# EAGLE design F4_mini2 (EAGLE 7.2.0)
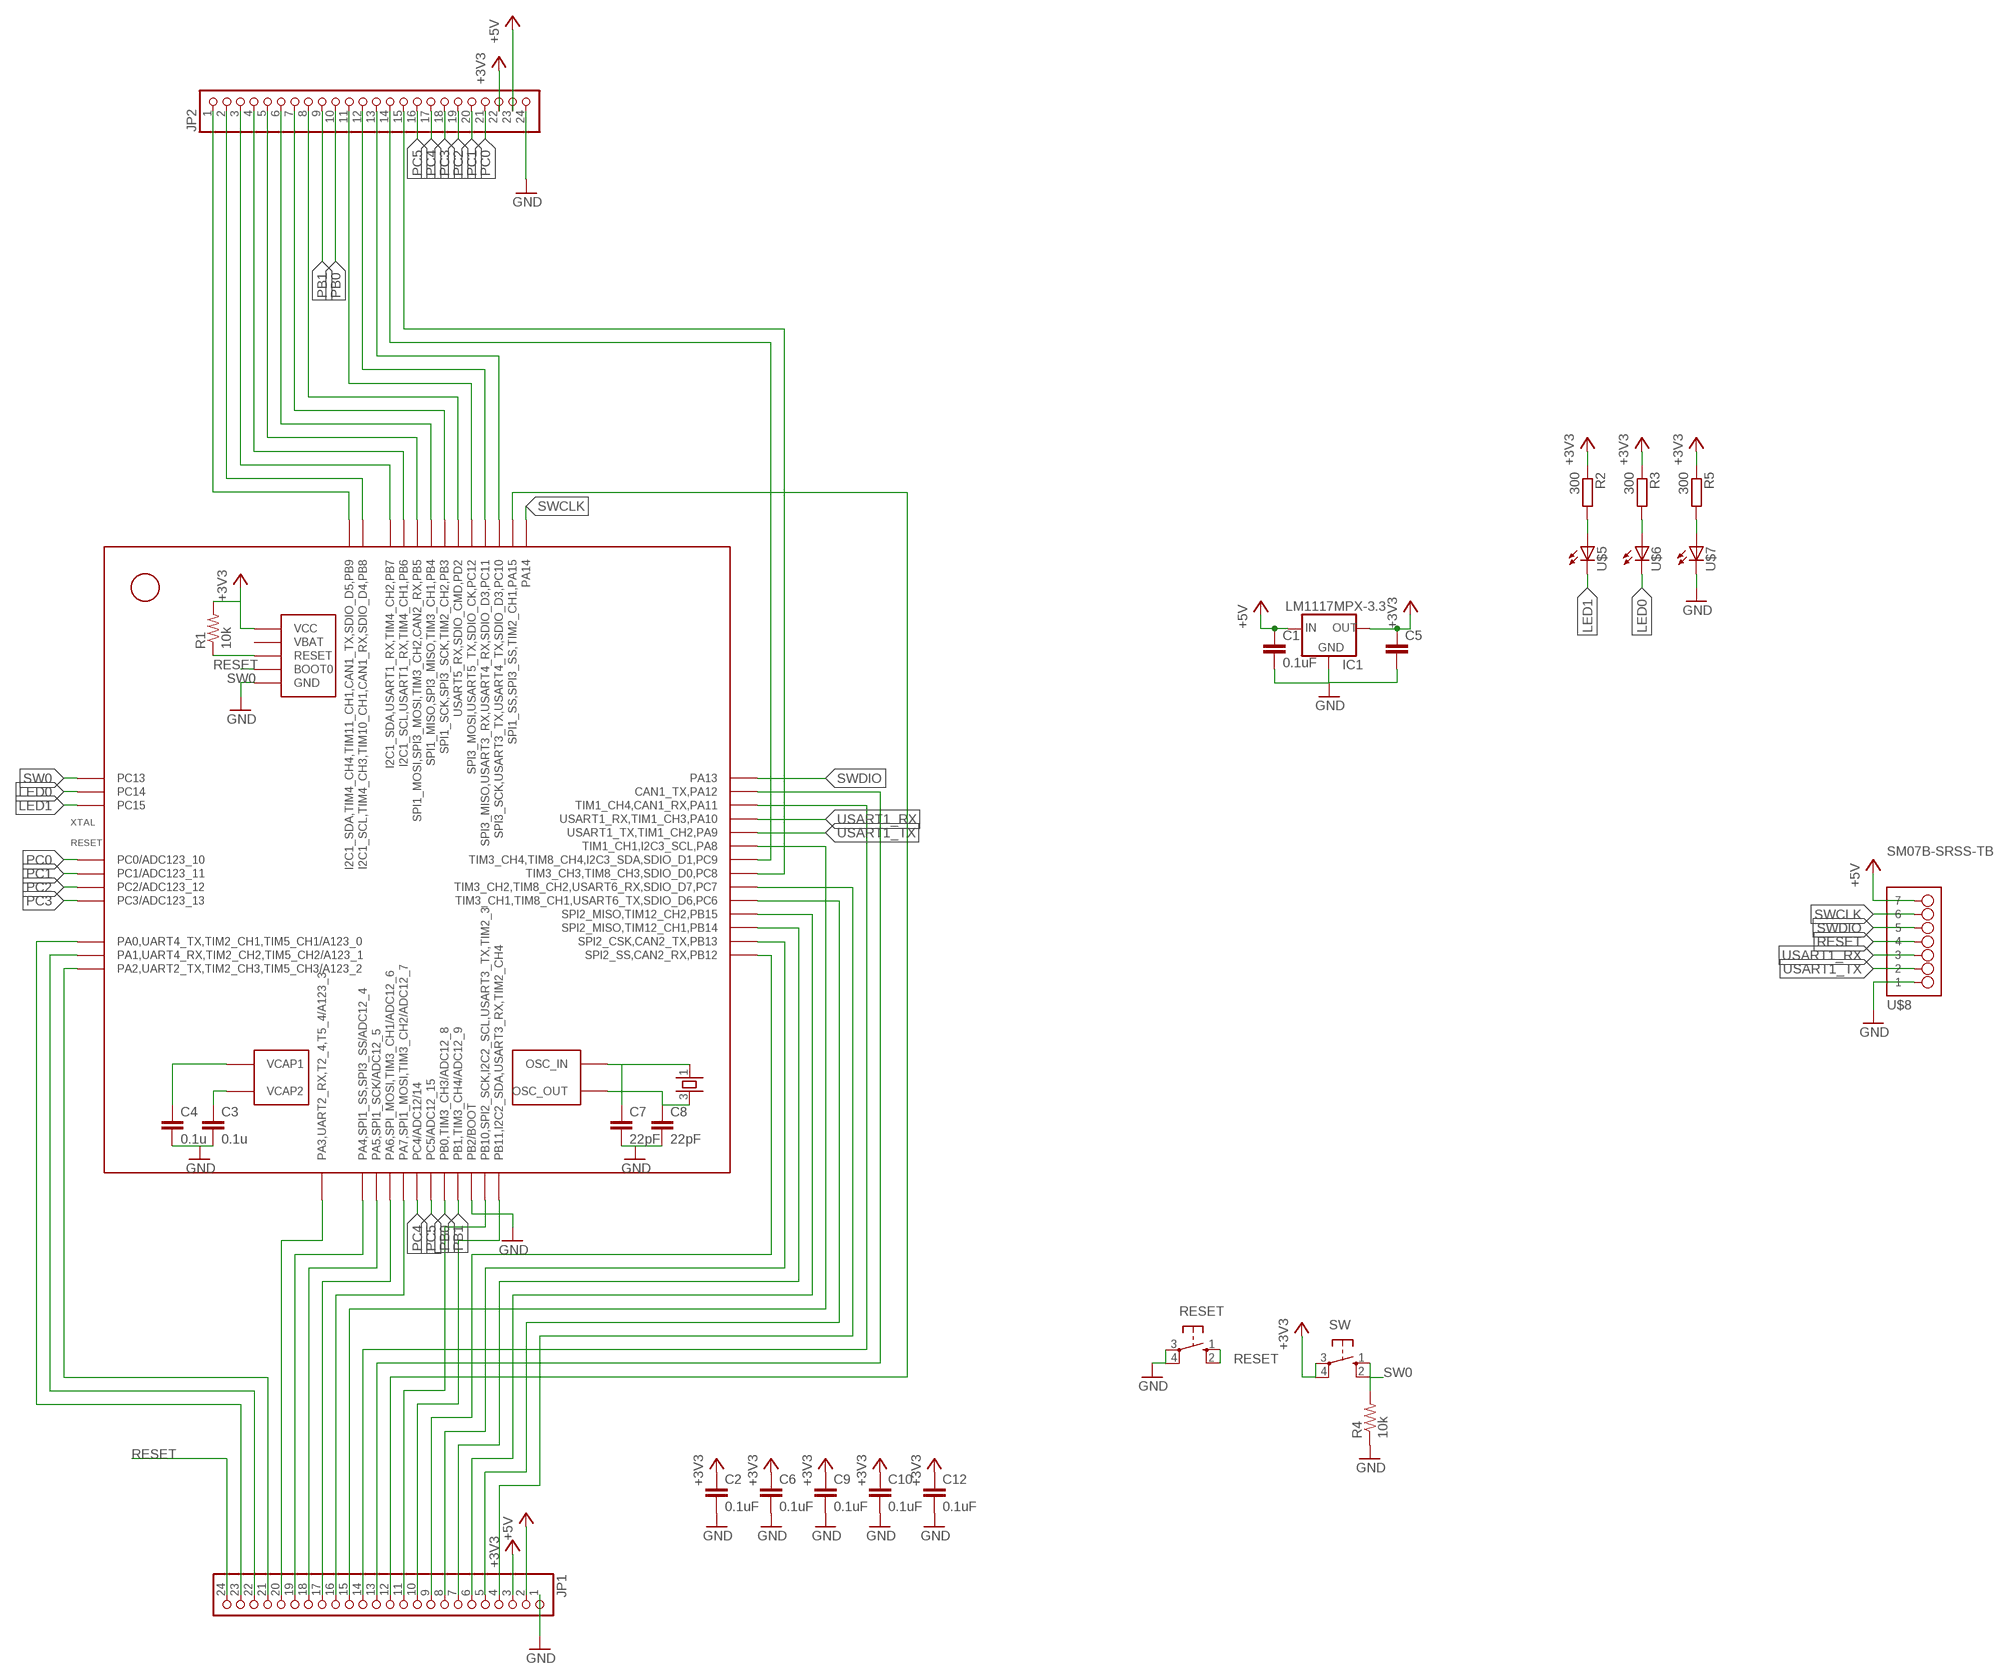
[diagram p0: schematic, sheet 1]

## Parts
C1  0.1uF  C-EUC0603K  [C0603K]
C2  0.1uF  C-EUC0603  [C0603]
C3  0.1u  C-EUC0603K  [C0603K]
C4  0.1u  C-EUC0603K  [C0603K]
C5  C-EUC0603K  [C0603K]
C6  0.1uF  C-EUC0603  [C0603]
C7  22pF  C-EUC0603K  [C0603K]
C8  22pF  C-EUC0603K  [C0603K]
C9  0.1uF  C-EUC0603  [C0603]
C10  0.1uF  C-EUC0603  [C0603]
C12  0.1uF  C-EUC0603  [C0603]
IC1  LM1117MPX-3.3  LM1117  [SOT223]
JP1  PINHD-1X24  [1X24]
JP2  PINHD-1X24  [1X24]
R1  10k  R-US_R0603  [R0603]
R2  300  R-EU_R0603  [R0603]
R3  300  R-EU_R0603  [R0603]
R4  10k  R-US_R0603  [R0603]
R5  300  R-EU_R0603  [R0603]
RESET  10-XX  [B3F-10XX]
SW  10-XX  [B3F-10XX]
U$1  STM32F405_T  [LQFP64]
U$4  25MHz  ASF_T  [ASF]
U$5  0603  [0603]
U$6  0603  [0603]
U$7  0603  [0603]
U$8  SM07B-SRSS-TB  [SM07B-SRSS-TB]

## Nets
+3V3: C2.1 C5.1 C6.1 C9.1 C10.1 C12.1 IC1.2(OUT1) IC1.4(OUT) JP1.3 JP2.22 R1.2 R2.1 R3.1 R5.1 SW.3(P) SW.4(P1) U$1.13(VCC) U$1.19(VCC) U$1.32(VCC) U$1.48(VCC) U$1.64(VCC)
+5V: C1.1 IC1.3(IN) JP1.2 JP2.23 U$8.P$7
A: JP2.3 U$1.59(I2C1_SDA,USART1_RX,TIM4_CH2,PB7)
GND: C1.2 C2.2 C3.2 C4.2 C5.2 C6.2 C7.2 C8.2 C9.2 C10.2 C12.2 IC1.1(GND) JP1.1 JP2.24 R4.1 RESET.3(P) RESET.4(P1) U$1.12(GND) U$1.18(GND) U$1.28(PB2/BOOT) U$1.63(GND) U$7.C U$8.P$1
LED0: U$1.3(PC14) U$6.C
LED1: U$1.4(PC15) U$5.C
N$1: R2.2 U$5.A
N$2: JP1.21 U$1.16(PA2,UART2_TX,TIM2_CH3,TIM5_CH3/A123_2)
N$3: JP1.23 U$1.14(PA0,UART4_TX,TIM2_CH1,TIM5_CH1/A123_0)
N$4: JP1.22 U$1.15(PA1,UART4_RX,TIM2_CH2,TIM5_CH2/A123_1)
N$5: JP1.15 U$1.41(TIM1_CH1,I2C3_SCL,PA8)
N$6: JP1.17 U$1.22(PA6,SPI_MOSI,TIM3_CH1/ADC12_6)
N$7: JP1.18 U$1.21(PA5,SPI1_SCK/ADC12_5)
N$8: JP1.19 U$1.20(PA4,SPI1_SS,SPI3_SS/ADC12_4)
N$9: JP1.20 U$1.17(PA3,UART2_RX,T2_4,T5_4/A123_3)
N$10: JP1.5 U$1.37(TIM3_CH1,TIM8_CH1,USART6_TX,SDIO_D6,PC6)
N$11: R3.2 U$6.A
N$12: R5.2 U$7.A
N$13: JP1.14 U$1.44(TIM1_CH4,CAN1_RX,PA11)
N$14: JP1.13 U$1.45(CAN1_TX,PA12)
N$15: JP1.4 U$1.38(TIM3_CH2,TIM8_CH2,USART6_RX,SDIO_D7,PC7)
N$17: JP1.16 U$1.23(PA7,SPI1_MOSI,TIM3_CH2/ADC12_7)
N$18: JP2.2 U$1.61(I2C1_SCL,TIM4_CH3,TIM10_CH1,CAN1_RX,SDIO_D4,PB8)
N$19: JP2.1 U$1.62(I2C1_SDA,TIM4_CH4,TIM11_CH1,CAN1_TX,SDIO_D5,PB9)
N$20: JP1.8 U$1.34(SPI2_CSK,CAN2_TX,PB13)
N$21: JP1.9 U$1.33(SPI2_SS,CAN2_RX,PB12)
N$22: JP1.10 U$1.30(PB11,I2C2_SDA,USART3_RX,TIM2_CH4)
N$23: JP1.11 U$1.29(PB10,SPI2_SCK,I2C2_SCL,USART3_TX,TIM2_3)
N$24: JP1.12 U$1.50(SPI1_SS,SPI3_SS,TIM2_CH1,PA15)
N$27: JP2.4 U$1.58(I2C1_SCL,USART1_RX,TIM4_CH1,PB6)
N$28: JP2.5 U$1.57(SPI1_MOSI,SPI3_MOSI,TIM3_CH2,CAN2_RX,PB5)
N$30: JP2.6 U$1.56(SPI1_MISO,SPI3_MISO,TIM3_CH1,PB4)
N$31: JP2.7 U$1.55(SPI1_SCK,SPI3_SCK,TIM2_CH2,PB3)
N$32: JP2.8 U$1.54(USART5_RX,SDIO_CMD,PD2)
N$38: JP2.11 U$1.53(SPI3_MOSI,USART5_TX,SDIO_CK,PC12)
N$39: JP2.12 U$1.52(SPI3_MISO,USART3_RX,USART4_RX,SDIO_D3,PC11)
N$40: JP2.13 U$1.51(SPI3_SCK,USART3_TX,USART4_TX,SDIO_D3,PC10)
N$41: C3.1 U$1.47(VCAP2)
N$42: C4.1 U$1.31(VCAP1)
N$43: JP2.14 U$1.40(TIM3_CH4,TIM8_CH4,I2C3_SDA,SDIO_D1,PC9)
N$44: C7.1 U$1.5(OSC_IN) U$4.1
N$45: C8.1 U$1.6(OSC_OUT) U$4.3
N$46: JP2.15 U$1.39(TIM3_CH3,TIM8_CH3,SDIO_D0,PC8)
PB0: JP2.10 U$1.26(PB0,TIM3_CH3/ADC12_8)
PB1: JP2.9 U$1.27(PB1,TIM3_CH4/ADC12_9)
PB14: JP1.7 U$1.35(SPI2_MISO,TIM12_CH1,PB14)
PB15: JP1.6 U$1.36(SPI2_MISO,TIM12_CH2,PB15)
PC0: JP2.21 U$1.8(PC0/ADC123_10)
PC1: JP2.20 U$1.9(PC1/ADC123_11)
PC2: JP2.19 U$1.10(PC2/ADC123_12)
PC3: JP2.18 U$1.11(PC3/ADC123_13)
PC4: JP2.17 U$1.24(PC4/ADC12/14)
PC5: JP2.16 U$1.25(PC5/ADC12_15)
RESET: JP1.24 R1.1 RESET.1(S) RESET.2(S1) U$1.7(RESET) U$8.P$4
SW0: R4.2 SW.1(S) SW.2(S1) U$1.2(PC13) U$1.60(BOOT0)
SWCLK: U$1.49(PA14) U$8.P$6
SWDIO: U$1.46(PA13) U$8.P$5
USART1_RX: U$1.43(USART1_RX,TIM1_CH3,PA10) U$8.P$3
USART1_TX: U$1.42(USART1_TX,TIM1_CH2,PA9) U$8.P$2
Unconnected: U$1.1(VBAT)

## Library data of the parts
C1-C10 C12 = resistor:C-EU: CAPACITOR, European symbol
IC1 = VoltageRegulator:LM1117
JP1 JP2 = pinhead:PINHD-1X24: PIN HEADER
R1 R4 = resistor:R-US_: RESISTOR, American symbol
R2 R3 R5 = resistor:R-EU_: RESISTOR, European symbol
RESET SW = switch-omron:10-XX: OMRON SWITCH; MPN: B3F-1000; OC_FARNELL: 176432; OC_NEWARK: 36M3542
U$1 = stm32f:STM32F405_T
U$4 = crystal:ASF_T
U$5-U$7 = led_0603:0603
U$8 = con-jst-sh:SM07B-SRSS-TB

## Board
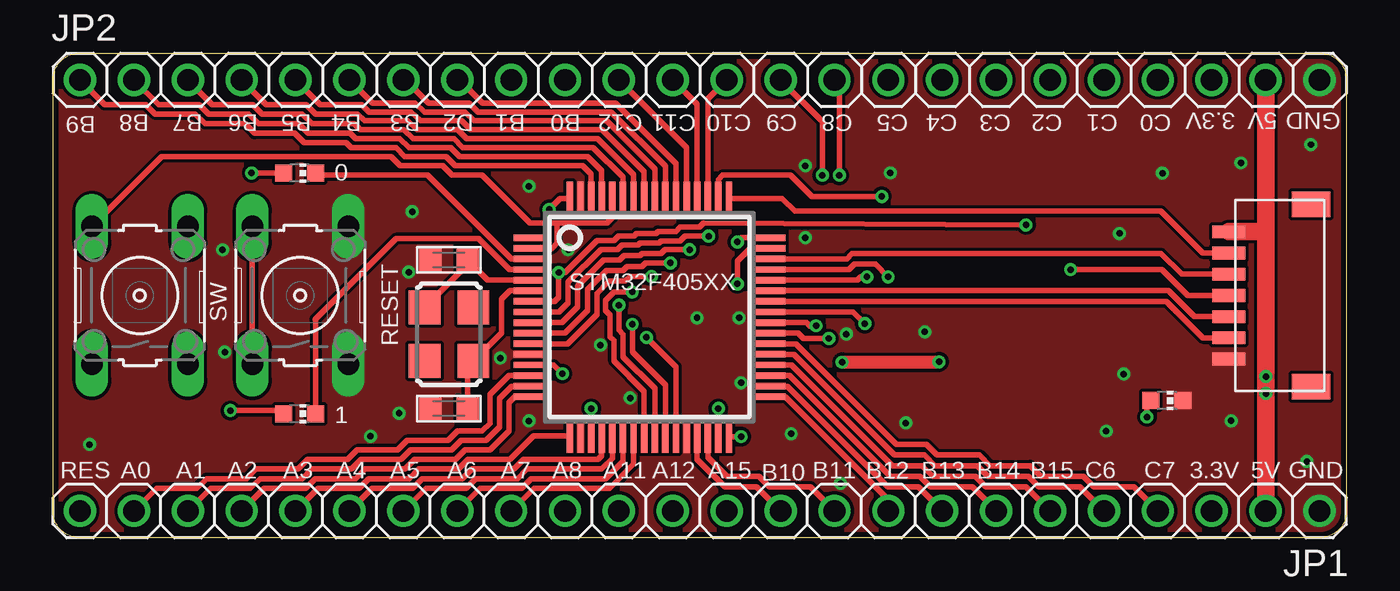
[diagram p1: board, top side]
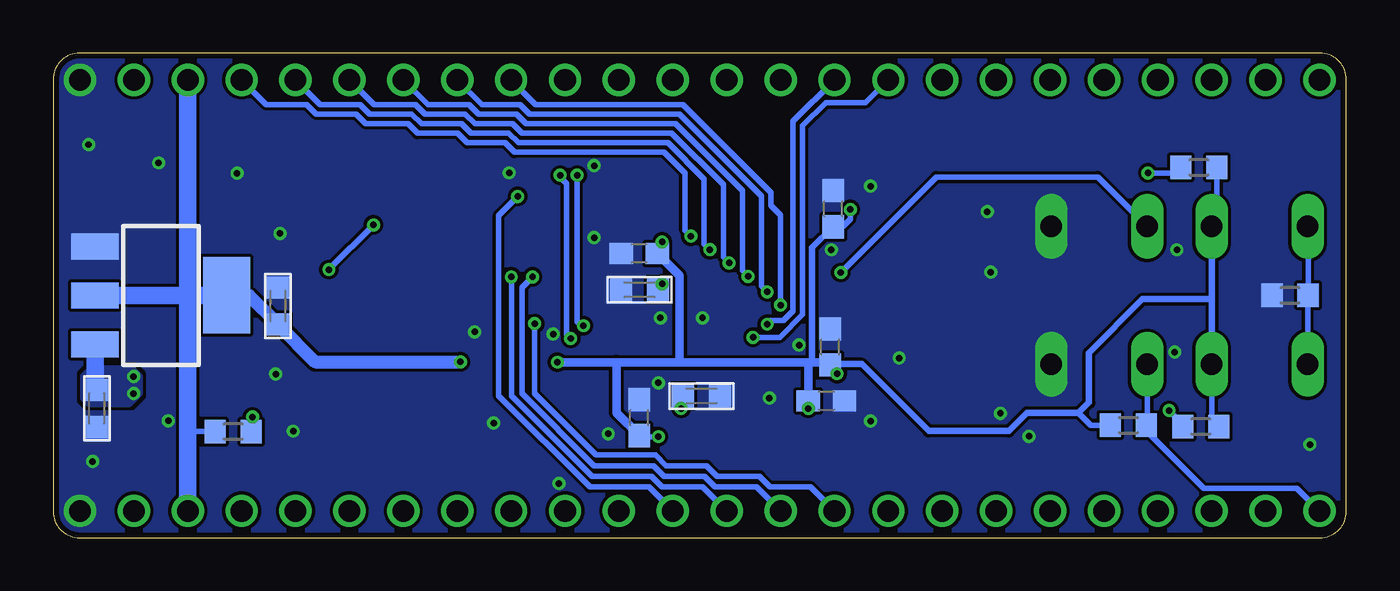
[diagram p2: board, bottom side, seen from below]

Size 60.96 x 22.86 mm. Coordinates in mm from the lower left corner, seen from the top.
Outline: 0,21.61 arc-90 1.25,22.86 59.71,22.86 arc-90 60.96,21.61 60.96,1.25 arc-90 59.71,0 1.25,0 arc-90 0,1.25 0,21.61
Copper layers (1*16): Top 0.035mm / dielectric 1.5mm / Bottom 0.035mm
Design rules "hoge": minimum track width 6mil, minimum drill 12mil, track to track 6mil, track to pad 6mil, pad to pad 6mil, via to via 6mil, smd to smd 0mil, copper to edge 10mil, drill to drill 10mil, minimum pad ring 10mil, minimum via ring 6mil, stop-mask expansion 2mil, vias tented up to drill 100mil, thermal gap 10mil

### Footprints (pad centres in the part's own frame; a part is rotated, then mirrored left to right if it is on the bottom)
C0603K = smd 1.05 x 1.08: 1 -0.875,0; 2 0.875,0
C0603 = smd 1.1 x 1: 1 -0.85,0; 2 0.85,0
SOT223 = smd 1.219 x 2.235: 1 -2.311,-3.099; 2 0,-3.099; 3 2.311,-3.099 | smd 3.6 x 2.2: 4 0,3.099
1X24 = drill 1.016: 1 -29.21,0; 2 -26.67,0; 3 -24.13,0; 4 -21.59,0; 5 -19.05,0; 6 -16.51,0; 7 -13.97,0; 8 -11.43,0; 9 -8.89,0; 10 -6.35,0; 11 -3.81,0; 12 -1.27,0; 13 1.27,0; 14 3.81,0; 15 6.35,0; 16 8.89,0; 17 11.43,0; 18 13.97,0; 19 16.51,0; 20 19.05,0; 21 21.59,0; 22 24.13,0; 23 26.67,0; 24 29.21,0
R0603 = smd 1 x 1.1: 1 -0.85,0; 2 0.85,0
B3F-10XX = drill 1.016 long: 1 -3.251,2.261; 2 3.251,2.261; 3 -3.251,-2.261; 4 3.251,-2.261
LQFP64 = smd 1.6 x 0.3: 1 -5.6,3.75; 2 -5.6,3.25; 3 -5.6,2.75; 4 -5.6,2.25; 5 -5.6,1.75; 6 -5.6,1.25; 7 -5.6,0.75; 8 -5.6,0.25; 9 -5.6,-0.25; 10 -5.6,-0.75; 11 -5.6,-1.25; 12 -5.6,-1.75; 13 -5.6,-2.25; 14 -5.6,-2.75; 15 -5.6,-3.25; 16 -5.6,-3.75; 33 5.6,-3.75; 34 5.6,-3.25; 35 5.6,-2.75; 36 5.6,-2.25; 37 5.6,-1.75; 38 5.6,-1.25; 39 5.6,-0.75; 40 5.6,-0.25; 41 5.6,0.25; 42 5.6,0.75; 43 5.6,1.25; 44 5.6,1.75; 45 5.6,2.25; 46 5.6,2.75; 47 5.6,3.25; 48 5.6,3.75 | smd 0.3 x 1.6: 17 -3.75,-5.6; 18 -3.25,-5.6; 19 -2.75,-5.6; 20 -2.25,-5.6; 21 -1.75,-5.6; 22 -1.25,-5.6; 23 -0.75,-5.6; 24 -0.25,-5.6; 25 0.25,-5.6; 26 0.75,-5.6; 27 1.25,-5.6; 28 1.75,-5.6; 29 2.25,-5.6; 30 2.75,-5.6; 31 3.25,-5.6; 32 3.75,-5.6; 49 3.75,5.6; 50 3.25,5.6; 51 2.75,5.6; 52 2.25,5.6; 53 1.75,5.6; 54 1.25,5.6; 55 0.75,5.6; 56 0.25,5.6; 57 -0.25,5.6; 58 -0.75,5.6; 59 -1.25,5.6; 60 -1.75,5.6; 61 -2.25,5.6; 62 -2.75,5.6; 63 -3.25,5.6; 64 -3.75,5.6
ASF = smd 1.6 x 1.5: 1 -1.25,-1.15; 2 1.25,-1.15; 3 1.25,1.15; 4 -1.25,1.15
0603 = smd 0.8 x 0.8: A 0,-0.75; C 0,0.75
SM07B-SRSS-TB = smd 0.6 x 1.55: P$1 -3,0; P$2 -2,0; P$3 -1,0; P$4 0,0; P$5 1,0; P$6 2,0; P$7 3,0 | smd 1.2 x 1.8: P$8 -4.3,-3.875; P$9 4.3,-3.875

### Placement (x,y rotation side)
C1  58.9,6.1 270 bottom
C2  24.33,9 90 bottom
C3  33.32,11.7 180 bottom
C4  30.4,6.69 0 bottom
C5  50.36,10.93 90 bottom
C6  24.19,15.52 90 bottom
C7  18.66,13.1 180 top
C8  18.66,6.1 180 top
C9  24.51,6.46 0 bottom
C10  33.33,5.67 90 bottom
C12  33.33,13.41 180 bottom
IC1  55.88,11.43 270 bottom
JP1  30.48,1.27 180 top
JP2  30.48,21.59 0 top
R1  10.28,5.31 180 bottom
R2  6.86,5.25 180 bottom
R3  6.96,17.47 180 bottom
R4  2.66,11.44 0 bottom
R5  52.47,5.01 0 bottom
RESET  11.65,11.43 90 top
SW  4.09,11.43 90 top
U$1  28.11,10.4 0 top
U$4  18.66,9.6 270 top
U$5  11.62,5.85 270 top
U$6  11.62,17.2 270 top
U$7  52.5,6.47 270 top
U$8  55.42,11.43 90 top

### Tracks (layer width: path | path; a pad name or v marks a point on that pad's centre or on a via)
+3V3  (via drill 0.3)
  Top 0.254: v32.25,13.95 32.45,14.15 U$1.48 | U$1.32 31.89,4.77 v32.43,4.77 | U$1.64 23.9,16 v23.38,15.48 | U$1.13 23.6,8.15 v24.01,7.74 | U$1.19 v25.36,6.1
  Top 0.61: v41.76,8.3 41.74,8.28 v37.19,8.28
  Bottom 0.254: v32.25,13.95 32.25,13.64 C12.1 | v32.43,4.77 33.28,4.77 C10.1 | R1.2 12.04,5.31 12.62,5.89 | v23.38,15.48 23.38,15.03 23.74,14.67 C6.1 | 24.46,8.28 C2.1 24.01,7.83 v24.01,7.74 | v25.36,6.1 C9.1 | R3.1 6.11,14.92 SW.4 | SW.3 6.35,5.59 R2.1 | R5.1 54.6,5.01 54.61,5
  Bottom 0.305: C6.1 25.18,13.68 25.18,8.28 | C2.1 24.29,8.19 22.84,8.19 19.69,5.04 15.91,5.04 15.05,5.89 12.62,5.89 12.14,6.38 12.14,8.72 9.61,11.25 6.4,11.25 6.35,11.2 | SW.4 6.35,11.2 | 6.35,11.2 SW.3
  Bottom 0.406: v37.19,8.28 34.41,8.28 | 34.41,8.28 31.44,8.28 | 31.44,8.28 25.41,8.28 | 25.41,8.28 25.18,8.28 24.46,8.28 | C12.1 31.44,12.37 31.44,8.28 | C9.1 25.36,8.23 25.41,8.28 | C10.1 34.41,5.9 34.41,8.28
  Bottom 0.61: IC1.4 51.73,11.43 C5.1 48.61,8.3 v41.76,8.3
  Bottom 0.813: JP2.22 54.61,11.3 | 54.61,11.3 54.61,5 JP1.3 | IC1.2 54.74,11.43 54.61,11.3 | IC1.4 54.48,11.43 54.61,11.3
+5V  (via drill 0.3)
  Top 0.254: v57.16,6.8 57.16,5.51 57.15,5.5
  Top 0.813: JP2.23 57.15,14.5 | 57.15,14.5 57.15,5.5 JP1.2 | U$8.P$7 57.08,14.43 57.15,14.5
  Bottom 0.813: IC1.3 58.98,7.05 C1.1
  other vias: 57.16,7.6
  pour Bottom (no thermals): 57.26,8 59.16,8 59.56,7.6 59.56,6.6 59.26,6.3 57.36,6.3 56.86,6.8 56.86,7.6
A
  Top 0.254: U$1.59 26.86,17 25.46,18.4 19.31,18.4 18.89,18.82 16.97,18.82 16.52,19.24 14.47,19.24 14.18,19.53 12.2,19.53 11.75,19.98 9.86,19.98 9.41,20.43 7.51,20.43 JP2.3
GND  (via drill 0.3)
  other vias: 55.99,17.68 52.29,17.19 37.12,2.56 34.79,4.91 55.53,5.52 59.28,18.54 59.1,3.6 50.26,14.35 50.46,7.72 39.46,17.21 49.64,5.03 32.33,10.37 30.35,10.37 32.43,7.31 27.2,6.59 22.43,5.51 14.96,4.79 16.31,5.87 16.76,12.53 7.99,13.58 8.09,8.76 1.72,4.4 22.43,16.58 21.08,8.48 35.46,17.55 35.46,14.15 24.28,13.58 40.19,5.41 41.09,9.71 37.39,9.61 25.8,9.09 16.93,15.38
  pour Top (rank 6, no thermals): -4,26.86 67.5,26.86 67.5,-4 -4,-4
  pour Bottom (rank 6, no thermals): -2,24.86 62.96,24.86 62.96,-2 -2,-2
LED0
  Top 0.254: U$6.C 12.47,17.1 17.66,17.1 21.61,13.15 U$1.3
LED1
  Top 0.254: U$1.4 21.51,12.65 20.06,14.1 16.16,14.1 12.36,10.3 12.37,10.29 U$5.C
N$1  (via drill 0.3)
  Top 0.254: v8.36,6 10.72,6 U$5.A
  Bottom 0.254: R2.2 7.71,5.35 v8.36,6
N$2
  Top 0.254: U$1.16 21.75,6.65 21.49,6.39 21.49,5.04 20.59,4.14 19.42,4.14 18.97,3.69 17.04,3.69 16.59,3.24 14.7,3.24 14.25,2.79 12.36,2.79 11.91,2.34 9.96,2.34 JP1.21
N$3
  Top 0.254: U$1.14 21.49,7.65 20.59,6.75 20.59,5.4 20.23,5.04 19.06,5.04 18.61,4.59 16.68,4.59 16.23,4.14 14.34,4.14 13.89,3.69 12,3.69 11.55,3.24 9.57,3.24 9.12,2.79 7.23,2.79 6.78,2.34 4.88,2.34 JP1.23
N$4
  Top 0.254: U$1.15 21.62,7.15 21.04,6.57 21.04,5.22 20.41,4.59 19.24,4.59 18.79,4.14 16.86,4.14 16.41,3.69 14.52,3.69 14.07,3.24 12.18,3.24 11.73,2.79 9.75,2.79 9.3,2.34 7.42,2.34 JP1.22
N$5  (via drill 0.3)
  Top 0.254: U$1.41 37.71,10.65 v38.26,10.1
  Bottom 0.254: JP1.15 25.26,2.4 27.16,2.4 27.66,2.9 29.66,2.9 30.16,3.4 32.06,3.4 32.56,3.9 35.36,3.9 38.26,6.8 v38.26,10.1
N$6
  Top 0.254: U$1.22 26.86,3.61 26.04,2.79 22.53,2.79 22.08,2.34 20.12,2.34 JP1.17
N$7
  Top 0.254: U$1.21 26.36,3.74 25.86,3.24 22.35,3.24 21.9,2.79 19.92,2.79 19.47,2.34 17.58,2.34 JP1.18
N$8
  Top 0.254: U$1.20 25.86,3.87 25.68,3.69 22.17,3.69 21.72,3.24 19.74,3.24 19.29,2.79 17.4,2.79 16.95,2.34 15.04,2.34 JP1.19
N$9
  Top 0.254: U$1.17 22.65,4.8 21.54,3.69 19.56,3.69 19.11,3.24 17.22,3.24 16.77,2.79 14.88,2.79 14.43,2.34 12.5,2.34 JP1.20
N$10
  Top 0.254: U$1.37 34.91,8.65 39.66,3.9 41.06,3.9 41.56,3.4 43.56,3.4 44.06,2.9 45.96,2.9 46.46,2.4 48.4,2.4 JP1.5
N$11  (via drill 0.3)
  Top 0.254: U$6.A v9.36,17.2
  Bottom 0.254: v9.36,17.2 8.08,17.2 R3.2
N$12  (via drill 0.3)
  Top 0.254: v51.56,5.7 51.56,6.28 U$7.A
  Bottom 0.254: R5.2 51.56,5.07 v51.56,5.7
N$13  (via drill 0.3)
  Top 0.254: U$1.44 37.91,12.15 38.06,12.3 v38.36,12.3
  Bottom 0.254: JP1.14 27.8,2.4 29.76,2.4 30.26,2.9 32.16,2.9 32.66,3.4 35.46,3.4 38.86,6.8 38.86,11.8 v38.36,12.3
N$14  (via drill 0.3)
  Top 0.254: U$1.45 37.51,12.65 37.76,12.9 38.76,12.9 v39.36,12.3
  Bottom 0.254: JP1.13 30.34,2.4 32.26,2.4 32.76,2.9 35.56,2.9 39.36,6.7 v39.36,12.3
N$15
  Top 0.254: U$1.38 35.01,9.15 39.76,4.4 41.16,4.4 41.66,3.9 43.66,3.9 44.16,3.4 46.06,3.4 46.56,2.9 48.56,2.9 49.06,2.4 50.94,2.4 JP1.4
N$17
  Top 0.254: U$1.23 27.36,3.48 26.22,2.34 22.66,2.34 JP1.16
N$18
  Top 0.254: U$1.61 25.86,17.32 25.2,17.98 19.15,17.98 18.73,18.4 16.79,18.4 16.34,18.82 14.26,18.82 14,19.08 12.02,19.08 11.57,19.53 9.68,19.53 9.23,19.98 7.34,19.98 6.89,20.43 4.97,20.43 JP2.2
N$19
  Top 0.254: U$1.62 25.36,17.15 24.95,17.56 18.94,17.56 18.52,17.98 16.58,17.98 16.16,18.4 14.05,18.4 13.82,18.63 11.84,18.63 11.39,19.08 9.5,19.08 9.05,19.53 7.16,19.53 6.71,19.98 4.82,19.98 4.37,20.43 2.43,20.43 JP2.1
N$20
  Top 0.254: U$1.34 34.61,7.15 39.36,2.4 40.78,2.4 JP1.8
N$21
  Top 0.254: U$1.33 34.51,6.65 39.37,1.79 JP1.9
N$22
  Top 0.254: U$1.30 30.86,3.8 31.76,2.9 33.26,2.9 33.76,2.4 35.7,2.4 JP1.10
N$23
  Top 0.254: U$1.29 30.36,3.7 31.66,2.4 33.16,2.4 JP1.11
N$24  (via drill 0.3)
  Top 0.254: U$1.50 31.36,16.9 31.56,17.1 34.76,17.1 35.76,16.1 v39.06,16.1
  Bottom 0.254: v39.06,16.1 39.96,15.2 39.96,6.7 35.66,2.4 32.88,2.4 JP1.12
N$27
  Top 0.254: U$1.58 27.36,17.13 25.67,18.82 19.49,18.82 19.07,19.24 17.15,19.24 16.7,19.66 14.68,19.66 14.36,19.98 12.38,19.98 11.93,20.43 10.05,20.43 JP2.4
N$28
  Top 0.254: U$1.57 27.86,17.26 25.88,19.24 19.67,19.24 19.25,19.66 17.33,19.66 16.88,20.08 14.89,20.08 14.54,20.43 12.59,20.43 JP2.5
N$30
  Top 0.254: U$1.56 28.36,17.39 26.09,19.66 19.85,19.66 19.43,20.08 17.51,20.08 17.06,20.5 15.06,20.5 JP2.6
N$31
  Top 0.254: U$1.55 28.86,17.52 26.3,20.08 20.03,20.08 19.61,20.5 17.7,20.5 16.61,21.59 JP2.7
N$32
  Top 0.254: U$1.54 29.36,17.65 26.51,20.5 20.24,20.5 19.15,21.59 JP2.8
N$38
  Top 0.254: U$1.53 29.86,18.4 JP2.11
N$39
  Top 0.254: U$1.52 30.36,20.44 JP2.12
N$40
  Top 0.254: U$1.51 30.86,20.7 JP2.13
N$41  (via drill 0.3)
  Top 0.254: v32.25,11.97 32.25,13.05 32.85,13.65 U$1.47
  Bottom 0.254: C3.1 32.25,11.89 v32.25,11.97
N$42  (via drill 0.3)
  Top 0.254: v31.36,6.1 U$1.31
  Bottom 0.254: C4.1 31.36,6.61 v31.36,6.1
N$43  (via drill 0.3)
  Top 0.254: U$1.40 35.51,10.15 35.66,10 v35.96,10 | v36.26,17.1 36.26,19.62 JP2.14
  Bottom 0.254: v35.96,10 36.06,10 36.26,10.2 v36.26,17.1
N$44
  Top 0.254: U$1.5 20.48,12.15 C7.1 19.54,12.88 U$4.1
N$45
  Top 0.254: C8.1 19.54,8.07 U$4.3 21.13,9.67 21.13,11.25 21.53,11.65 U$1.6
N$46  (via drill 0.3)
  Top 0.254: U$1.39 35.11,9.65 35.36,9.4 v36.56,9.4 | v37.06,17.1 37.06,21.36 JP2.15
  Bottom 0.254: v36.56,9.4 36.76,9.6 36.76,16.7 37.06,17 v37.06,17.1
PB0  (via drill 0.3)
  Top 0.254: U$1.26 28.86,7.21 27.3,8.77 v27.3,10.07
  Bottom 0.254: v27.3,10.07 27.13,10.24 26.54,10.24 26.08,10.7 26.08,19.64 JP2.10
PB1  (via drill 0.3)
  Top 0.254: U$1.27 29.36,8.06 v27.97,9.45
  Bottom 0.254: v27.97,9.45 26.7,9.45 25.63,10.52 25.63,19.43 24.54,20.52 22.66,20.52 JP2.9
PB14
  Top 0.254: U$1.35 34.71,7.65 39.46,2.9 40.86,2.9 41.36,2.4 43.32,2.4 JP1.7
PB15
  Top 0.254: U$1.36 34.81,8.15 39.56,3.4 40.96,3.4 41.46,2.9 43.46,2.9 43.96,2.4 45.86,2.4 JP1.6
PC0  (via drill 0.3)
  Top 0.254: U$1.8 23.86,10.65 24.28,11.07 24.28,12.06 25.82,13.6 26.61,13.6 26.81,13.8 27.56,13.8 27.66,13.9 28.56,13.9 28.66,14 29.56,14 29.78,14.22 v30.9,14.22
  Bottom 0.254: v30.9,14.22 31.17,14.49 31.17,17.19 32.16,18.18 39.21,18.18 39.66,18.63 41.44,18.63 41.89,19.08 43.78,19.08 44.23,19.53 46.22,19.53 46.67,19.98 48.56,19.98 49.01,20.43 50.91,20.43 JP2.21
PC1  (via drill 0.3)
  Top 0.254: U$1.9 23.99,10.15 24.73,10.89 24.73,11.88 25.95,13.1 26.71,13.1 26.91,13.3 27.66,13.3 27.76,13.4 28.66,13.4 28.85,13.59 v30,13.59
  Bottom 0.254: v30,13.59 30.27,13.86 30.27,16.92 31.98,18.63 39.03,18.63 39.48,19.08 41.26,19.08 41.71,19.53 43.6,19.53 44.05,19.98 46.04,19.98 46.49,20.43 48.37,20.43 JP2.20
PC2  (via drill 0.3)
  Top 0.254: U$1.10 24.12,9.65 25.18,10.71 25.18,11.7 26.08,12.6 26.86,12.6 27.06,12.8 27.76,12.8 27.92,12.96 v29.1,12.96
  Bottom 0.254: v29.1,12.96 29.37,13.23 29.37,16.65 31.8,19.08 38.85,19.08 39.3,19.53 41.08,19.53 41.53,19.98 43.42,19.98 43.87,20.43 45.83,20.43 JP2.19
PC3  (via drill 0.3)
  Top 0.254: U$1.11 24.25,9.15 25.63,10.53 25.63,11.52 26.21,12.1 26.96,12.1 27.19,12.33 v28.2,12.33
  Bottom 0.254: v28.2,12.33 28.47,12.6 28.47,16.38 31.62,19.53 38.67,19.53 39.12,19.98 40.9,19.98 41.35,20.43 43.29,20.43 JP2.18
PC4  (via drill 0.3)
  Top 0.254: U$1.24 27.86,6.91 26.44,8.33 26.44,9.3 26.26,9.48 26.26,10.5 26.04,10.72 26.04,11.2 26.44,11.6 v27.3,11.6
  Bottom 0.254: v27.3,11.6 27.57,11.87 27.57,16.11 31.44,19.98 38.49,19.98 38.94,20.43 40.75,20.43 JP2.17
PC5  (via drill 0.3)
  Top 0.254: U$1.25 28.36,7.04 26.86,8.54 26.86,9.6 26.67,9.79 v26.67,10.97
  Bottom 0.254: v26.67,10.97 26.67,15.21 27.12,15.66 27.12,16.29 31.26,20.43 38.21,20.43 JP2.16
RESET  (via drill 0.3)
  Top 0.254: RESET.2 RESET.1 | U$1.7 23.64,11.15 23.83,11.34 v23.83,12.51 24.12,12.51 25.63,14.02 26.45,14.02 26.65,14.22 27.38,14.22 27.51,14.35 28.41,14.35 28.51,14.45 29.36,14.45 29.56,14.65 30.46,14.65 30.66,14.85 v45.86,14.75 | U$8.P$4 53.49,11.43 52.27,12.65 v47.96,12.65
  Bottom 0.254: RESET.1 9.39,5.35 R1.1 9.43,5.04 6.73,2.34 2.34,2.34 JP1.24 | v23.83,12.51 19.33,17.01 11.72,17.01 RESET.2 | v45.86,14.75 v47.96,12.65
SW0
  Top 0.254: 23.76,14.85 22.48,14.85 20.23,17.1 18.81,17.1 18.35,17.56 16.35,17.56 15.93,17.98 5.13,17.98 SW.2 | 23.76,14.85 26.11,14.85 26.36,15.1 U$1.60 | U$1.2 23.51,13.65 23.76,13.9 23.76,14.85
  Bottom 0.254: SW.1 1.83,11.42 R4.2 1.81,14.66 SW.2
SWCLK
  Top 0.254: U$1.49 34.36,16 34.96,15.4 52.22,15.4 54.19,13.43 U$8.P$6
SWDIO
  Top 0.254: U$1.46 37.41,13.15 37.66,13.4 52.22,13.4 53.19,12.43 U$8.P$5
USART1_RX
  Top 0.254: U$1.43 52.57,11.65 53.79,10.43 U$8.P$3
USART1_TX
  Top 0.254: U$1.42 52.47,11.15 54.19,9.43 U$8.P$2

### Text on the board
tNames: B9 | B8 | B7 | B6 | B5 | B4 | B3 | D2 | B1 | B0 | C12 | C11 | C10 | C9 | C8 | C5 | C4 | C3 | C2 | C1 | C0 | 3.3V | 5V | GND | 0 | SW | RESET | 1 | RES | A0 | A1 | A2 | A3 | A4 | A5 | A6 | A7 | A8 | A11 | A12 | A15 | B10 | B11 | B12 | B13 | B14 | B15 | C6 | C7 | 3.3V | 5V | GND